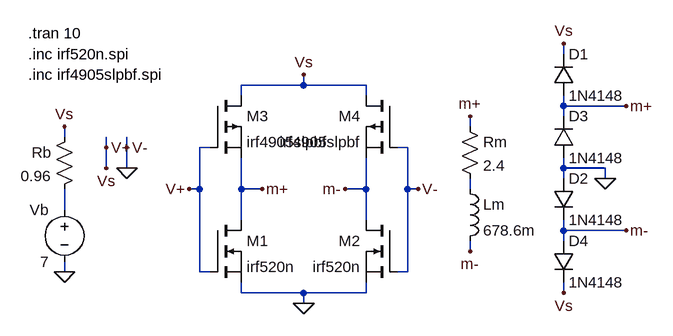
[diagram p0: schematic hbridge.asc]
hbridge.asc, the LTspice schematic file:
Version 4
SHEET 1 1412 680
WIRE 848 -64 848 -80
WIRE 448 -16 448 -32
WIRE 448 -16 352 -16
WIRE 544 -16 448 -16
WIRE 352 0 352 -16
WIRE 544 0 544 -16
WIRE 848 16 848 0
WIRE 944 16 848 16
WIRE 848 32 848 16
WIRE 704 48 704 32
WIRE 80 64 80 48
WIRE 144 80 144 64
WIRE 176 80 176 64
WIRE 304 80 288 80
WIRE 608 80 592 80
WIRE 144 112 144 80
WIRE 176 112 176 80
WIRE 848 112 848 96
WIRE 912 112 848 112
WIRE 848 128 848 112
WIRE 912 128 912 112
WIRE 288 144 288 80
WIRE 288 144 272 144
WIRE 352 144 352 96
WIRE 384 144 352 144
WIRE 544 144 544 96
WIRE 544 144 512 144
WIRE 608 144 608 80
WIRE 624 144 608 144
WIRE 704 144 704 128
WIRE 80 176 80 144
WIRE 352 192 352 144
WIRE 544 192 544 144
WIRE 848 208 848 192
WIRE 944 208 848 208
WIRE 848 224 848 208
WIRE 704 240 704 224
WIRE 80 272 80 256
WIRE 288 272 288 144
WIRE 304 272 288 272
WIRE 608 272 608 144
WIRE 608 272 592 272
WIRE 352 304 352 288
WIRE 448 304 352 304
WIRE 544 304 544 288
WIRE 544 304 448 304
WIRE 848 304 848 288
WIRE 448 320 448 304
FLAG 80 272 0
FLAG 80 48 Vs
FLAG 704 32 m+
FLAG 704 240 m-
FLAG 384 144 m+
FLAG 512 144 m-
FLAG 448 320 0
FLAG 448 -32 Vs
FLAG 944 16 m+
FLAG 848 -80 Vs
FLAG 848 304 Vs
FLAG 944 208 m-
FLAG 912 128 0
FLAG 624 144 V-
FLAG 272 144 V+
FLAG 144 80 V+
FLAG 176 80 V-
FLAG 144 112 Vs
FLAG 176 112 0
SYMBOL voltage 80 160 M0
SYMATTR InstName Vb
SYMATTR Value 7
SYMBOL res 96 48 M0
SYMATTR InstName Rb
SYMATTR Value 0.96
SYMBOL res 688 32 R0
SYMATTR InstName Rm
SYMATTR Value 2.4
SYMBOL ind 688 128 R0
SYMATTR InstName Lm
SYMATTR Value 678.6m
SYMBOL nmos 304 192 R0
SYMATTR InstName M1
SYMATTR Value irf520n
SYMATTR Prefix X
SYMBOL nmos 592 192 M0
SYMATTR InstName M2
SYMATTR Value irf520n
SYMATTR Prefix X
SYMBOL pmos 304 0 R0
SYMATTR InstName M3
SYMATTR Value irf4905slpbf
SYMATTR Prefix X
SYMBOL pmos 592 0 M0
SYMATTR InstName M4
SYMATTR Value irf4905slpbf
SYMATTR Prefix X
SYMBOL diode 832 0 M180
WINDOW 0 24 64 Left 2
WINDOW 3 24 0 Left 2
SYMATTR InstName D1
SYMATTR Value 1N4148
SYMBOL diode 832 96 M180
WINDOW 0 24 64 Left 2
WINDOW 3 24 0 Left 2
SYMATTR InstName D3
SYMATTR Value 1N4148
SYMBOL diode 832 128 R0
SYMATTR InstName D2
SYMATTR Value 1N4148
SYMBOL diode 832 224 R0
SYMATTR InstName D4
SYMATTR Value 1N4148
TEXT 24 -96 Left 2 !.tran 10
TEXT 24 -64 Left 2 !.inc irf520n.spi
TEXT 24 -32 Left 2 !.inc irf4905slpbf.spi

The netlist it stands for:
* hbridge.asc
Vb N002 0 7
Rb V+ N002 0.96
Rm m+ N001 2.4
Lm N001 m- 678.6m
XM1 m+ V+ 0 irf520n  ; pins D G S
XM2 m- 0 0 irf520n  ; pins D G S
XM3 V+ V+ m+ irf4905slpbf  ; pins D G S
XM4 V+ 0 m- irf4905slpbf  ; pins D G S
D1 m+ V+ 1N4148
D3 0 m+ 1N4148
D2 0 m- 1N4148
D4 m- V+ 1N4148
.model D D
.lib standard.dio
.tran 10
.inc irf520n.spi
.inc irf4905slpbf.spi
.backanno
.end